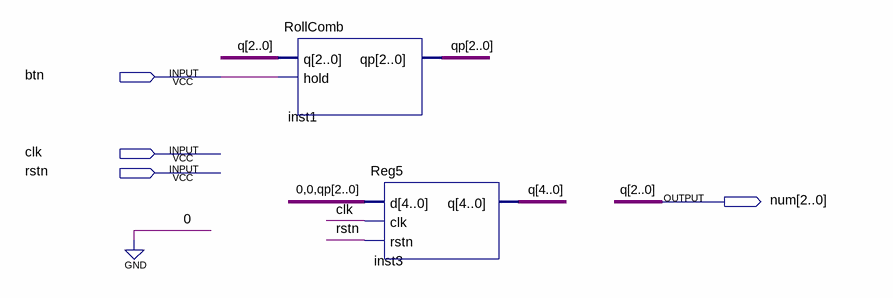
[diagram p0: schematic sheet]
// Quartus schematic RollInner.bdf as structural Verilog: 2 symbols, 4 pins
module RollInner (
  input  btn,
  input  clk,
  input  rstn,
  output [2:0] num
);

  wire [2:0] qp;
  wire [4:3] q;

  RollComb inst1 (.q(num), .hold(btn), .qp(qp));
  Reg5 inst3 (.d({2'b00, qp}), .clk(clk), .rstn(rstn), .q({q, num}));

  // Other names for the same wires on the sheet: q[2:0] = num
endmodule
